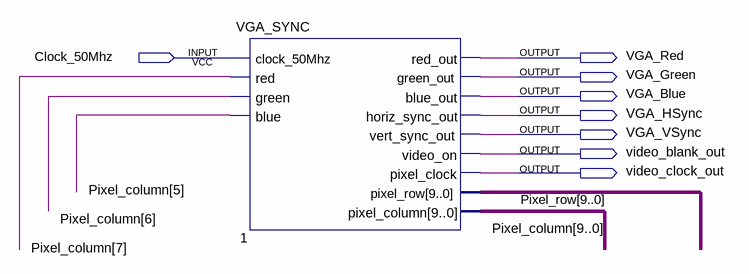
[diagram p0: schematic sheet]
// Quartus schematic VGA_BAR.bdf as structural Verilog: 1 symbols, 8 pins
module VGA_BAR (
  input  Clock_50Mhz,
  output VGA_Red,
  output VGA_Green,
  output VGA_Blue,
  output VGA_HSync,
  output VGA_VSync,
  output video_blank_out,
  output video_clock_out
);

  wire [9:0] Pixel_column, Pixel_row;

  VGA_SYNC u_1 (
    .red(Pixel_column[7]), .green(Pixel_column[6]), .blue(Pixel_column[5]), .clock_50Mhz(Clock_50Mhz),
    .red_out(VGA_Red), .green_out(VGA_Green), .blue_out(VGA_Blue), .horiz_sync_out(VGA_HSync),
    .vert_sync_out(VGA_VSync), .video_on(video_blank_out), .pixel_clock(video_clock_out),
    .pixel_row(Pixel_row), .pixel_column(Pixel_column));
endmodule
